# Altium schematic sheet 3.3V_BuckDesign.SchDoc: Buck
size 431 x 279 mm; Author: Changran Liu / Kaiwen Zhou; CompanyName: Upenn; DrawnBy: Changran Liu / Kaiwen Zhou; Engineer: Changran Liu / Kaiwen Zhou; Organization: Upenn; DocumentNumber: 6; SheetNumber: 5; SheetTotal: 9
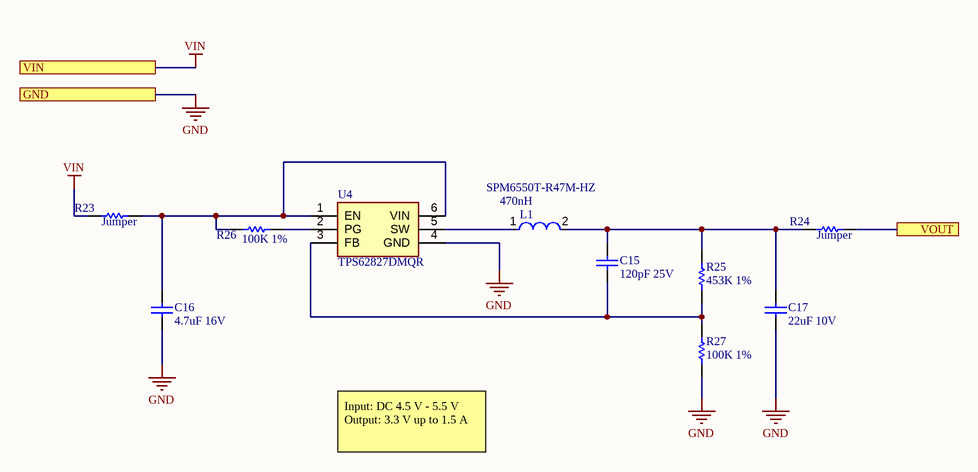
[diagram p0: 3.3V_BuckDesign.SchDoc]

## Parts
C15  120pF 25V  [CAPC0603(1608)100_N]
C16  4.7uF 16V  [CAPC0805(2012)145_N]
C17  22uF 10V  [CAPC0805(2012)100_L]
L1  SPM6550T-R47M-HZ  Inductance: 470nH  [FP-SPM6550-MFG]
R23  Jumper  [RESC0603(1608)_N]
R24  Jumper  [RESC0603(1608)_N]
R25  453K 1%  [RESC0402(1005)_L]
R26  100K 1%  [RESC0603(1608)_N]
R27  100K 1%  [RESC0603(1608)_N]
U4  TPS62827DMQR  [TPS6282518DMQR]

## Ports
GND, VIN, VOUT

## Nets
GND: C16.1 C17.1 R27.1 U4.4(GND) ; port GND
VIN: R23.1 ; port VIN
VOUT: R24.2 ; port VOUT
NetC15_1: C15.1 R25.1 R27.2 U4.3(FB)
NetC15_2: C15.2 C17.2 L1.2 R24.1 R25.2
NetC16_2: C16.2 R23.2 R26.1 U4.1(EN) U4.6(VIN)
NetL1_1: L1.1 U4.5(SW)
NetR26_2: R26.2 U4.2(PG)

## Notes on the sheet
- Input: DC 4.5 V - 5.5 V Output: 3.3 V up to 1.5 A
- DWG. NO.
- REV.
- SHT.
- THIS DOCUMENT AND THE DATA DISCLOSED HEREIN OR HEREWITH IS THE PROPERTY OF ALTIUM LIMITED AND MAY BE FREELY DISTRIBUTED IN WHOLE. NO RIGHTS ARE RESERVED OR EXPRESS OR IMPLIED WARANTEE GIVEN.
- REVISION
- DESCRIPTION
- DATE
- APPROVED
- ENG:
- APPROVALS
- PROJECT
- DSN:
- CHK:
- REFERENCE DOCUMENTS
- PROJECT REVISION:
- TITLE
- DOCUMENT REVISION:
- DESIGN ITEM:
- BOM:
- FAB DWG:
- PCB DWG:
- ASSY DWG:
- SCALE:
- SIZE
- B
- CAGE CODE
- FILE NAME
- DWG NO.
- SHEET
- OF
- REV

## Library data of the parts
C15 = CMP-1035-01312-1: CAP 120pF 25V ±1% 0603 (1608 Metric) Thickness 1mm SMD; Case-Metric: 1608; Case-EIA: 0603; Tolerance: Â±1%; Value: 120pF; Technology: SMT; Max Thickness: 1 mm; Rated Voltage: 25 V
C16 = CMP-1036-04893-1: CAP 4.7uF 16V -20% to +80% 0805 (2012 Metric) Thickness 1.45mm SMD; Case-Metric: 2012; Case-EIA: 0805; Max Thickness: 1.45 mm; Value: 4.7uF; Rated Voltage: 16 V; Tolerance: -20% to +80%; Technology: SMT
C17 = CMP-1036-04944-1: CAP 22uF 10V ±20% 0805 (2012 Metric) Thickness 1mm SMD; Case-Metric: 2012; Case-EIA: 0805; Tolerance: Â±20%; Technology: SMT; Max Thickness: 1 mm; Value: 22uF; Rated Voltage: 10 V
L1 = CMP-08253-000017-1: FIX IND 470NH 26.1A 2.97MOHM SMD; Manufacturer: TDK; Core Material: Metal; Shielding: true; Series Resistance: 2.97mΩ; Test Frequency: 100kHz; Rms Current: 20.5A; Automotive Grade: Grade 1; Tolerance: 20%; Standoff Height: 0.15mm; Lead Free: Yes; Manufacturer Part Number: SPM6550T-R47M-HZ; Automotive: Yes; ComponentLink2URL: https://product.tdk.com/info/en/catalog/datasheets/inductor_automotive_power_spm6550-hz_en.pdf; Temperature Range High: +125°C; Category: Ind; Height: 5mm; Device Class L2: Inductors; Device Class L3: Fixed Inductors; Temperature Range Low: -40°C; RoHS: TRUE; Temperature: -40°C to +125°C; ComponentLink2Description: Datasheet; Device Class L1: Passive Components; Package: SPM6550; Saturation Current: 20.5A; Digikey Description: FIX IND 470NH 26.1A 2.97MOHM SMD; Composition: Wirewound; Octopart: https://octopart.com/spm6550t-r47m-hz-tdk-90326484; Value: 470nH
R23 R24 = CMP-1012-00001-1: Jumper 0603 (1608 Metric); Case-Metric: 1608; Value: 0.00 Ohm; Power: None; Case-EIA: 0603; Technology: SMT; Tolerance: None
R25 = CMP-1011-00810-1: 453K 0.063W 1% 0402 (1005 Metric)  SMD; Value: 453000.00 Ohm; Case-Metric: 1005; Case-EIA: 0402; Tolerance: 1 %; Power: 0.063 W; Technology: SMT
R26 R27 = CMP-1012-00736-1: 100K 0.1W 1% 0603 (1608 Metric)  SMD; Value: 100000.00 Ohm; Case-Metric: 1608; Case-EIA: 0603; Power: 0.1 W; Tolerance: 1 %; Technology: SMT
U4 = TPS62827DMQR: 2.4V-5.5V input, 4A step-down converter with 1% Accuracy in 1.5mm x 1.5mm QFN 6-VSON-HR -40 to 125; Manufacturer_Name: Texas Instruments; Datasheet Link: http://www.ti.com/lit/ds/symlink/tps62827.pdf; Height: 1mm; Manufacturer_Part_Number: TPS62827DMQR; Mouser Part Number: 595-TPS62827DMQR; Mouser Price/Stock: https://www.mouser.co.uk/ProductDetail/Texas-Instruments/TPS62827DMQR?qs=byeeYqUIh0P9BITyOJrN9g%3D%3D; Arrow Part Number: TPS62827DMQR; Arrow Price/Stock: https://www.arrow.com/en/products/tps62827dmqr/texas-instruments